# Altium schematic sheet Toplevel.SchDoc
size A4; SheetNumber: 1; SheetTotal: 1
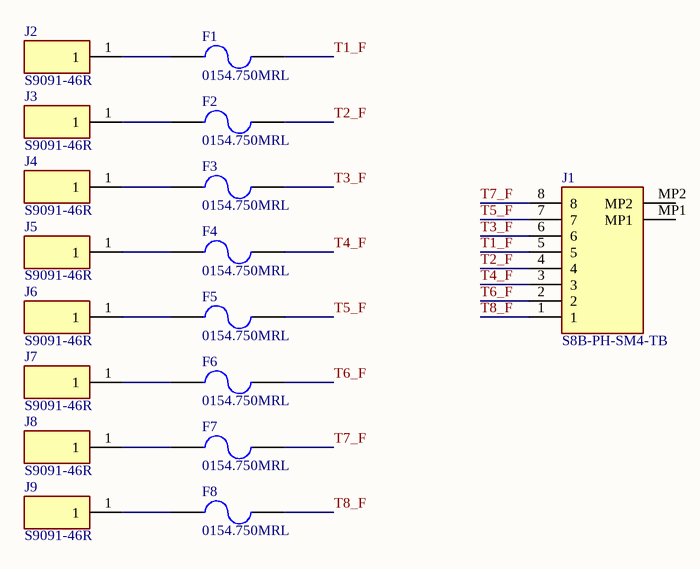
[diagram p0: Toplevel.SchDoc]

## Parts
F1  0154.750MRL  [0451Series_LTF]
F2  0154.750MRL  [0451Series_LTF]
F3  0154.750MRL  [0451Series_LTF]
F4  0154.750MRL  [0451Series_LTF]
F5  0154.750MRL  [0451Series_LTF]
F6  0154.750MRL  [0451Series_LTF]
F7  0154.750MRL  [0451Series_LTF]
F8  0154.750MRL  [0451Series_LTF]
J1  S8B-PH-SM4-TB  [S8BPHSM4TB]
J2  S9091-46R  [S909146R]
J3  S9091-46R  [S909146R]
J4  S9091-46R  [S909146R]
J5  S9091-46R  [S909146R]
J6  S9091-46R  [S909146R]
J7  S9091-46R  [S909146R]
J8  S9091-46R  [S909146R]
J9  S9091-46R  [S909146R]

## Nets
T1_F: F1.2 J1.5
T2_F: F2.2 J1.4
T3_F: F3.2 J1.6
T4_F: F4.2 J1.3
T5_F: F5.2 J1.7
T6_F: F6.2 J1.2
T7_F: F7.2 J1.8
T8_F: F8.2 J1.1
NetF1_1: F1.1 J2.1
NetF2_1: F2.1 J3.1
NetF3_1: F3.1 J4.1
NetF4_1: F4.1 J5.1
NetF5_1: F5.1 J6.1
NetF6_1: F6.1 J7.1
NetF7_1: F7.1 J8.1
NetF8_1: F8.1 J9.1

Not connected (* = marked no-connect by the designer): J1 MP1 MP2

## Library data of the parts
F1-F8 = 0154.750MRL: FUSE BOARD MNT 750MA 125VAC/VDC; Manufacturer: Littelfuse Inc.; Part Number: 0154.750MRL; Digikey Part Number: F2576CT-ND; Digikey Link: https://www.digikey.com.au/en/products/detail/littelfuse-inc/0451-750MRL/700816
J1 = S8B-PH-SM4-TB: Connector; Manufacturer_Name: JST (JAPAN SOLDERLESS TERMINALS); Height: 5.5mm; Manufacturer_Part_Number: S8B-PH-SM4-TB
J2-J9 = S9091-46R: Connector; Manufacturer_Name: Harwin; Datasheet Link: https://cdn.harwin.com/pdfs/S9091R.pdf; Height: 4.43mm; Manufacturer_Part_Number: S9091-46R; Mouser Part Number: 855-S9091-46R; Mouser Price/Stock: https://www.mouser.co.uk/ProductDetail/Harwin/S9091-46R?qs=2ymmDbJkxOgQCw1a7zdQYA%3D%3D